# Altium schematic sheet Interface.SchDoc
size A4; SheetNumber: 4; SheetTotal: 5
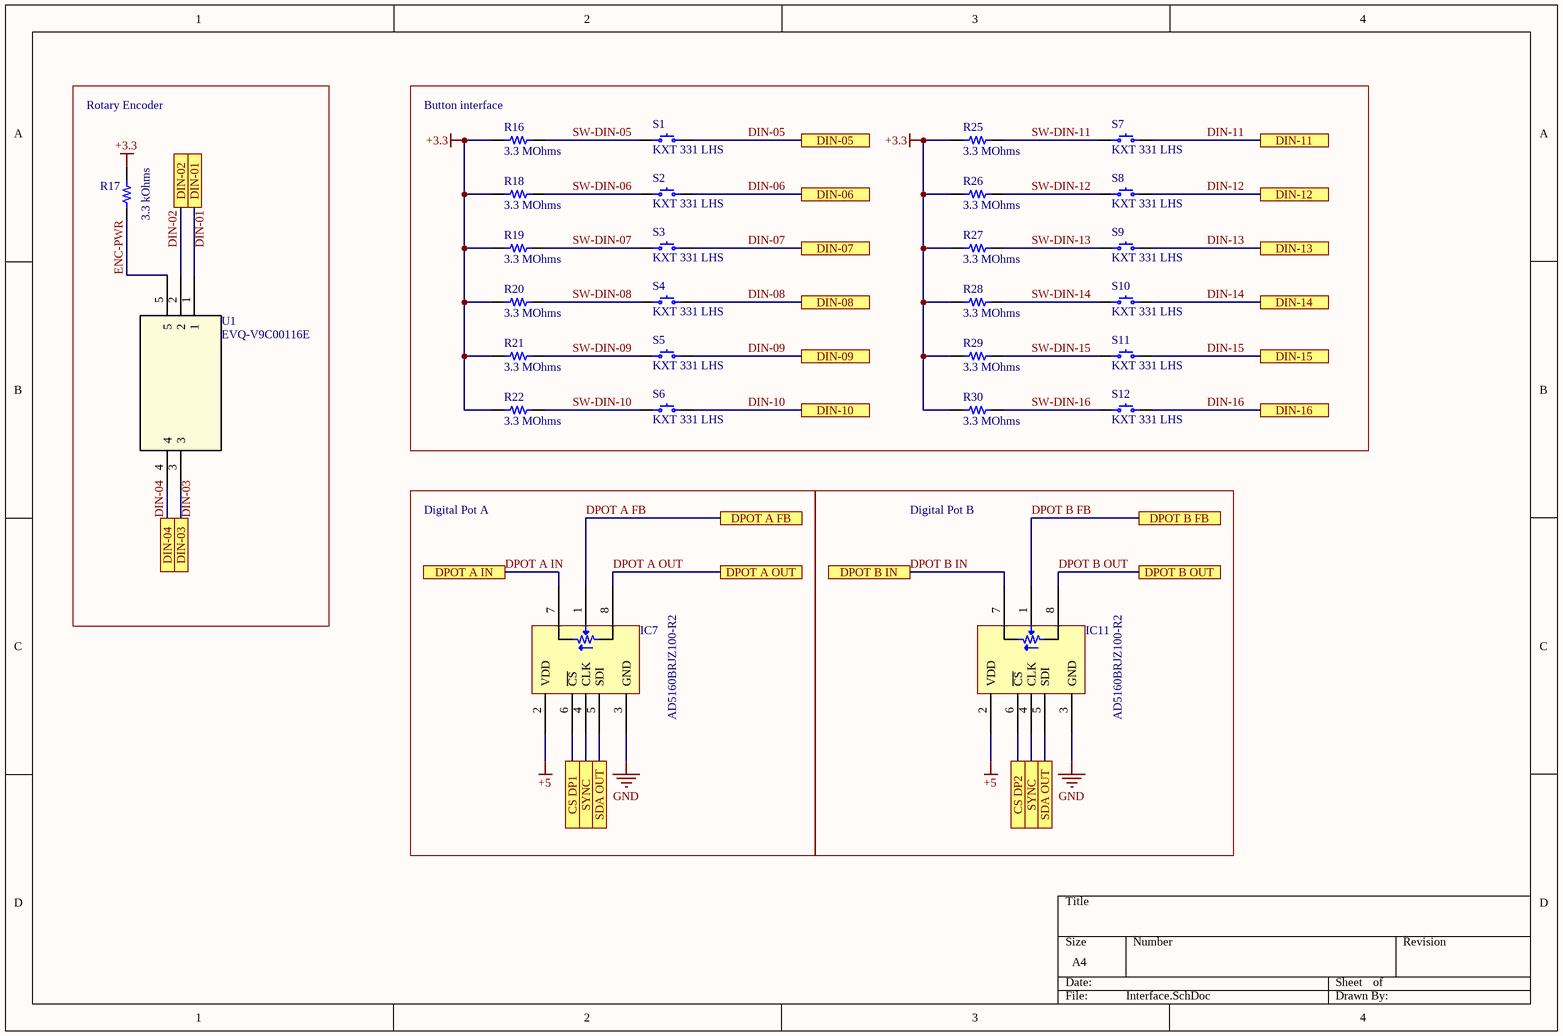
[diagram p0: Interface.SchDoc]

## Parts
IC7  AD5160BRJZ100-R2  [ANALOG SOT-23-8 RJ-8]
IC11  AD5160BRJZ100-R2  [ANALOG SOT-23-8 RJ-8]
R16  3.3 MOhms  [RES 1206_3216]
R17  3.3 kOhms  [RES 1206_3216]
R18  3.3 MOhms  [RES 1206_3216]
R19  3.3 MOhms  [RES 1206_3216]
R20  3.3 MOhms  [RES 1206_3216]
R21  3.3 MOhms  [RES 1206_3216]
R22  3.3 MOhms  [RES 1206_3216]
R25  3.3 MOhms  [RES 1206_3216]
R26  3.3 MOhms  [RES 1206_3216]
R27  3.3 MOhms  [RES 1206_3216]
R28  3.3 MOhms  [RES 1206_3216]
R29  3.3 MOhms  [RES 1206_3216]
R30  3.3 MOhms  [RES 1206_3216]
S1  KXT 331 LHS  [C&K KXT3]
S2  KXT 331 LHS  [C&K KXT3]
S3  KXT 331 LHS  [C&K KXT3]
S4  KXT 331 LHS  [C&K KXT3]
S5  KXT 331 LHS  [C&K KXT3]
S6  KXT 331 LHS  [C&K KXT3]
S7  KXT 331 LHS  [C&K KXT3]
S8  KXT 331 LHS  [C&K KXT3]
S9  KXT 331 LHS  [C&K KXT3]
S10  KXT 331 LHS  [C&K KXT3]
S11  KXT 331 LHS  [C&K KXT3]
S12  KXT 331 LHS  [C&K KXT3]
U1  EVQ-V9C00116E  [SW_EVQ-V9C00116E_PAN]

## Blocks framed on the sheet
Rotary Encoder: R17 U1
Button interface: R16 R18-R22 R25-R30 S1-S12
Digital Pot A: IC7
Digital Pot B: IC11

## Ports
CS DP1, CS DP2, DIN-01, DIN-02, DIN-03, DIN-04, DIN-05, DIN-06, DIN-07, DIN-08, DIN-09, DIN-10, DIN-11, DIN-12, DIN-13, DIN-14, DIN-15, DIN-16, DPOT A FB, DPOT A IN, DPOT A OUT, DPOT B FB, DPOT B IN, DPOT B OUT, SDA OUT, SYNC

## Nets
+3.3: R16.1 R17.2 R18.1 R19.1 R20.1 R21.1 R22.1 R25.1 R26.1 R27.1 R28.1 R29.1 R30.1
+5: IC7.2(VDD) IC11.2(VDD)
GND: IC7.3(GND) IC11.3(GND)
CS DP1: IC7.6(~{CS}) ; port CS DP1
CS DP2: IC11.6(~{CS}) ; port CS DP2
DIN-01: U1.1 ; port DIN-01
DIN-02: U1.2 ; port DIN-02
DIN-03: U1.3 ; port DIN-03
DIN-04: U1.4 ; port DIN-04
DIN-05: S1.2 ; port DIN-05
DIN-06: S2.2 ; port DIN-06
DIN-07: S3.2 ; port DIN-07
DIN-08: S4.2 ; port DIN-08
DIN-09: S5.2 ; port DIN-09
DIN-10: S6.2 ; port DIN-10
DIN-11: S7.2 ; port DIN-11
DIN-12: S8.2 ; port DIN-12
DIN-13: S9.2 ; port DIN-13
DIN-14: S10.2 ; port DIN-14
DIN-15: S11.2 ; port DIN-15
DIN-16: S12.2 ; port DIN-16
DPOT A FB: IC7.1(W) ; port DPOT A FB
DPOT A IN: IC7.7(A) ; port DPOT A IN
DPOT A OUT: IC7.8(B) ; port DPOT A OUT
DPOT B FB: IC11.1(W) ; port DPOT B FB
DPOT B IN: IC11.7(A) ; port DPOT B IN
DPOT B OUT: IC11.8(B) ; port DPOT B OUT
ENC-PWR: R17.1 U1.5
SDA OUT: IC7.5(SDI) IC11.5(SDI) ; port SDA OUT
SW-DIN-05: R16.2 S1.1
SW-DIN-06: R18.2 S2.1
SW-DIN-07: R19.2 S3.1
SW-DIN-08: R20.2 S4.1
SW-DIN-09: R21.2 S5.1
SW-DIN-10: R22.2 S6.1
SW-DIN-11: R25.2 S7.1
SW-DIN-12: R26.2 S8.1
SW-DIN-13: R27.2 S9.1
SW-DIN-14: R28.2 S10.1
SW-DIN-15: R29.2 S11.1
SW-DIN-16: R30.2 S12.1
SYNC: IC7.4(CLK) IC11.4(CLK) ; port SYNC

## Notes on the sheet
- Labels drawn without touching a wire or pin: DIN-01, DIN-03

## Library data of the parts
IC7 IC11 = AD5160BRJZ100-R2: IC DGTL POT 100KOHM 256TAP SOT23; Manufacturer: Analog Devices Inc.; Configuration: Potentiometer; Interface: SPI; Memory Type: Volatile; Number of Circuits: 1; Number of Taps: 256; Resistance (Ohms): 100k; Resistance - Wiper (Ohms) (Typ): 50; Temperature Coefficient (Typ): 45ppm/°C; Tolerance: ±15%; Voltage - Supply: 2.7V ~ 5.5V; Part Number: AD5160BRJZ100-R2; ComponentLink1Description: Datasheet; ComponentLink1URL: https://www.analog.com/media/en/technical-documentation/data-sheets/AD5160.pdf; ComponentLink2Description: DigiKey Link; ComponentLink2URL: http://digikey.com/product-detail/en/analog-devices-inc/AD5160BRJZ100-R2/AD5160BRJZ100-R2CT-ND/751230; LastUpdated: 3/06/2024 8:26:31 PM; Lifecycle Status: Active; Minimum Order: 1; Operating Temperature: -40°C ~ 125°C; Package / Case: SOT-23-8; Packaging: TapeAndReel; PartId: 39; Part Status: Active; Price: 1.68; Series: -; Supplier 1: DigiKey; Supplier Part Number 1: AD5160BRJZ100-R2CT-ND; Supplier Device Package: SOT-23-8; Taper: Linear
R16 R18-R22 R25-R30 = RG3216P-3304-B-T1: RES 3.3M OHM 0.1% 1/4W 1206; Manufacturer: Susumu; Power (Watts): 0.25W, 1/4W; Temperature Coefficient: ±25ppm/°C; Part Number: RG3216P-3304-B-T1; ComponentLink1Description: Datasheet; ComponentLink1URL: http://www.susumu.co.jp/common/pdf/n_catalog_partition01_en.pdf; ComponentLink2Description: DigiKey Link; ComponentLink2URL: https://www.digikey.com/en/products/detail/susumu/RG3216P-3304-B-T1/7035379; Composition: Thin Film; Device Package: 1206 (3216 Metric); Features: Anti-Sulfur, Automotive AEC-Q200; Height - Seated (Max): 0.020" (0.50mm); LastUpdated: 9/02/2024 8:54:00 PM; Lifecycle Status: Active; Minimum Order: 1; Number of Terminations: 2; Operating Temperature: -55°C ~ 155°C; Package / Case: 1206 (3216 Metric); Packaging: TapeAndReel; PartId: 38871; Part Status: Active; Price: 0.14; Ratings: AEC-Q200; Resistance: 3.3 MOhms; Series: RG; Size / Dimension: 0.126" L x 0.063" W (3.20mm x 1.60mm); Supplier 1: DigiKey; Supplier Part Number 1: 408-2035-1-ND; Supplier Device Package: 1206; Tolerance: ±0.1%; Value: 3.3 MOhms
R17 = ERA-8APB332V: RES SMD 3.3K OHM 0.1% 1/4W 1206; Manufacturer: Panasonic Electronic Components; Power (Watts): 0.25W, 1/4W; Temperature Coefficient: ±15ppm/°C; Part Number: ERA-8APB332V; ComponentLink1Description: Datasheet; ComponentLink1URL: https://industrial.panasonic.com/cdbs/www-data/pdf/RDM0000/AOA0000C307.pdf; ComponentLink2Description: DigiKey Link; ComponentLink2URL: https://www.digikey.com/en/products/detail/panasonic-electronic-components/ERA-8APB332V/5141025; Composition: Thin Film; Device Package: 1206 (3216 Metric); Features: Automotive AEC-Q200; Height - Seated (Max): 0.028" (0.70mm); LastUpdated: 9/02/2024 8:54:35 PM; Lifecycle Status: Active; Minimum Order: 1; Number of Terminations: 2; Operating Temperature: -55°C ~ 155°C; Package / Case: 1206 (3216 Metric); Packaging: TapeAndReel; PartId: 28968; Part Status: Active; Price: 0.31; Ratings: AEC-Q200; Resistance: 3.3 kOhms; Series: ERA-8A; Size / Dimension: 0.126" L x 0.063" W (3.20mm x 1.60mm); Supplier 1: DigiKey; Supplier Part Number 1: P3.3KCRCT-ND; Supplier Device Package: 1206; Tolerance: ±0.1%; Value: 3.3 kOhms
S1-S12 = KXT 331 LHS: SWITCH TACTILE SPST-NO 0.02A 15V; Manufacturer: C&K; Actuator Height off PCB, Vertical: 0.60mm; Actuator Orientation: Top Actuated; Actuator Type: Standard; Contact Rating @ Voltage: 0.02A @ 15VDC; Illumination: Non-Illuminated; Operating Force: 240gf; Outline: 3.00mm x 2.00mm; Switch Function: Off-Mom; Part Number: KXT 331 LHS; Circuit: SPST-NO; ComponentLink1Description: Datasheet; ComponentLink1URL: https://dznh3ojzb2azq.cloudfront.net/products/Tactile/KXT3/documents/datasheet.pdf; ComponentLink2Description: DigiKey Link; ComponentLink2URL: https://www.digikey.com/en/products/detail/c-k/KXT-331-LHS/6599754; LastUpdated: 3/06/2024 8:19:27 PM; Lifecycle Status: Active; Minimum Order: 1; Mounting Type: Surface Mount; Operating Temperature: -40°C ~ 85°C; Packaging: TapeAndReel; Part Status: Active; Price: 0.13; Series: KXT3; Supplier 1: DigiKey; Supplier Part Number 1: CKN10779CT-ND; Termination Style: SMD (SMT) Tab
U1 = EVQ-V9C00116E: No Description Available; Mfr_Name: Panasonic; RefDes: RefDes; Type: Type